# Altium schematic sheet BCM1.SchDoc
size A4; SheetNumber: 1; SheetTotal: 5
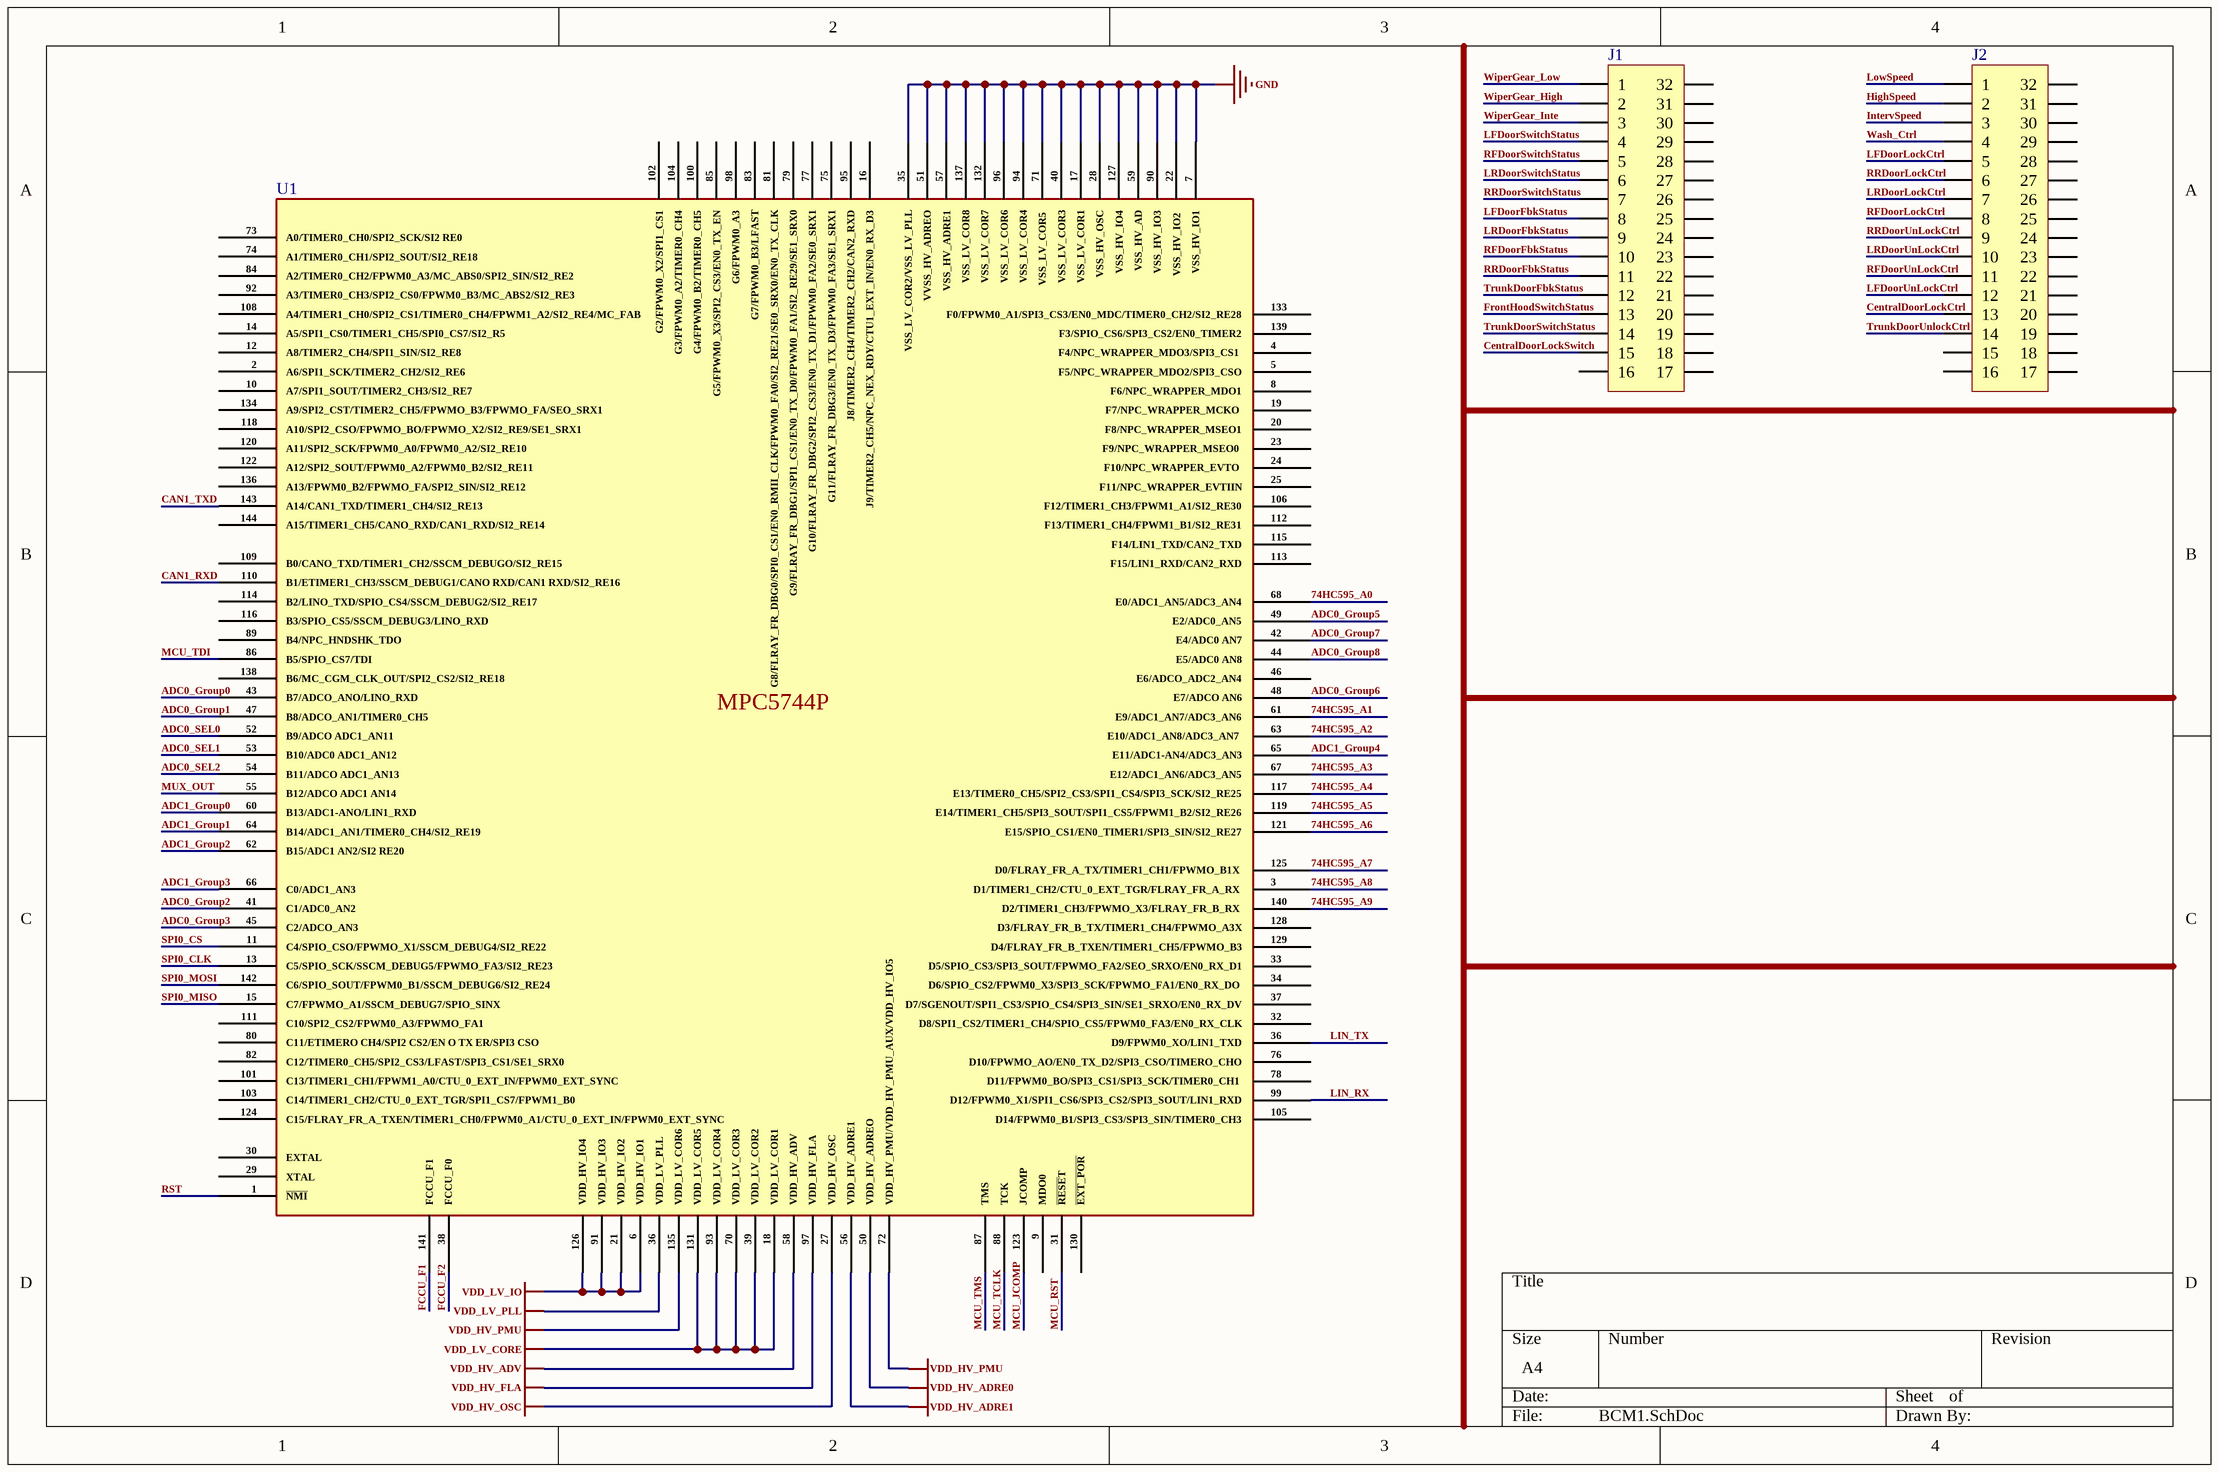
[diagram p0: BCM1.SchDoc]

## Parts
J1  DIP32  (value not drawn)
J2  DIP32  (value not drawn)
U1  MPC5744PFK1AMLQ9  (value not drawn)

## Nets
GND: U1.7(VSS_HV_IO1) U1.17(VSS_LV_COR1) U1.22(VSS_HV_IO2) U1.28(VSS_HV_OSC) U1.35(VSS_LV_COR2/VSS_LV_PLL) U1.40(VSS_LV_COR3) U1.51(VVSS_HV_ADREO) U1.57(VSS_HV_ADRE1) U1.59(VSS_HV_AD) U1.71(VSS_LV_COR5) U1.90(VSS_HV_IO3) U1.94(VSS_LV_COR4) U1.96(VSS_LV_COR6) U1.127(VSS_HV_IO4) U1.132(VSS_LV_COR7) U1.137(VSS_LV_COR8)
VDD_HV_ADRE0: U1.50(VDD_HV_ADREO)
VDD_HV_ADRE1: U1.56(VDD_HV_ADRE1)
VDD_HV_ADV: U1.58(VDD_HV_ADV)
VDD_HV_FLA: U1.97(VDD_HV_FLA)
VDD_HV_OSC: U1.27(VDD_HV_OSC)
VDD_HV_PMU: U1.72(VDD_HV_PMU/VDD_HV_PMU_AUX/VDD_HV_IO5) U1.135(VDD_LV_COR6)
VDD_LV_CORE: U1.18(VDD_LV_COR1) U1.39(VDD_LV_COR2) U1.70(VDD_LV_COR3) U1.93(VDD_LV_COR4) U1.131(VDD_LV_COR5)
VDD_LV_IO: U1.6(VDD_HV_IO1) U1.21(VDD_HV_IO2) U1.91(VDD_HV_IO3) U1.126(VDD_HV_IO4)
VDD_LV_PLL: U1.36(VDD_LV_PLL)
74HC595_A0: U1.68(E0/ADC1_AN5/ADC3_AN4)
74HC595_A1: U1.61(E9/ADC1_AN7/ADC3_AN6)
74HC595_A2: U1.63(E10/ADC1_AN8/ADC3_AN7)
74HC595_A3: U1.67(E12/ADC1_AN6/ADC3_AN5)
74HC595_A4: U1.117(E13/TIMER0_CH5/SPI2_CS3/SPI1_CS4/SPI3_SCK/SI2_RE25)
74HC595_A5: U1.119(E14/TIMER1_CH5/SPI3_SOUT/SPI1_CS5/FPWM1_B2/SI2_RE26)
74HC595_A6: U1.121(E15/SPIO_CS1/EN0_TIMER1/SPI3_SIN/SI2_RE27)
74HC595_A7: U1.125(D0/FLRAY_FR_A_TX/TIMER1_CH1/FPWMO_B1X)
74HC595_A8: U1.3(D1/TIMER1_CH2/CTU_0_EXT_TGR/FLRAY_FR_A_RX)
74HC595_A9: U1.140(D2/TIMER1_CH3/FPWMO_X3/FLRAY_FR_B_RX)
ADC0_Group0: U1.43(B7/ADCO_ANO/LINO_RXD)
ADC0_Group1: U1.47(B8/ADCO_AN1/TIMER0_CH5)
ADC0_Group2: U1.41(C1/ADC0_AN2)
ADC0_Group3: U1.45(C2/ADCO_AN3)
ADC0_Group5: U1.49(E2/ADC0_AN5)
ADC0_Group6: U1.48(E7/ADCO_AN6)
ADC0_Group7: U1.42(E4/ADC0_AN7)
ADC0_Group8: U1.44(E5/ADC0_AN8)
ADC0_SEL0: U1.52(B9/ADCO_ADC1_AN11)
ADC0_SEL1: U1.53(B10/ADC0_ADC1_AN12)
ADC0_SEL2: U1.54(B11/ADCO_ADC1_AN13)
ADC1_Group0: U1.60(B13/ADC1-ANO/LIN1_RXD)
ADC1_Group1: U1.64(B14/ADC1_AN1/TIMER0_CH4/SI2_RE19)
ADC1_Group2: U1.62(B15/ADC1_AN2/SI2_RE20)
ADC1_Group3: U1.66(C0/ADC1_AN3)
ADC1_Group4: U1.65(E11/ADC1-AN4/ADC3_AN3)
CAN1_RXD: U1.110(B1/ETIMER1_CH3/SSCM_DEBUG1/CANO_RXD/CAN1_RXD/SI2_RE16)
CAN1_TXD: U1.143(A14/CAN1_TXD/TIMER1_CH4/SI2_RE13)
CentralDoorLockCtrl: J2.13
CentralDoorLockSwitch: J1.15
FCCU_F1: U1.141(FCCU_F1)
FCCU_F2: U1.38(FCCU_F0)
FrontHoodSwitchStatus: J1.13
HighSpeed: J2.2
IntervSpeed: J2.3
LFDoorFbkStatus: J1.8
LFDoorLockCtrl: J2.5
LFDoorSwitchStatus: J1.4
LFDoorUnLockCtrl: J2.12
LIN_RX: U1.99(D12/FPWM0_X1/SPI1_CS6/SPI3_CS2/SPI3_SOUT/LIN1_RXD)
LIN_TX: U1.36(D9/FPWM0_XO/LIN1_TXD)
LowSpeed: J2.1
LRDoorFbkStatus: J1.9
LRDoorLockCtrl: J2.7
LRDoorSwitchStatus: J1.6
LRDoorUnLockCtrl: J2.10
MCU_JCOMP: U1.123(JCOMP)
MCU_RST: U1.31(~{RESE}T)
MCU_TCLK: U1.88(TCK)
MCU_TDI: U1.86(B5/SPIO_CS7/TDI)
MCU_TMS: U1.87(TMS)
MUX_OUT: U1.55(B12/ADCO_ADC1_AN14)
RFDoorFbkStatus: J1.10
RFDoorLockCtrl: J2.8
RFDoorSwitchStatus: J1.5
RFDoorUnLockCtrl: J2.11
RRDoorFbkStatus: J1.11
RRDoorLockCtrl: J2.6
RRDoorSwitchStatus: J1.7
RRDoorUnLockCtrl: J2.9
RST: U1.1(~{NMI})
SPI0_CLK: U1.13(C5/SPIO_SCK/SSCM_DEBUG5/FPWMO_FA3/SI2_RE23)
SPI0_CS: U1.11(C4/SPIO_CSO/FPWMO_X1/SSCM_DEBUG4/SI2_RE22)
SPI0_MISO: U1.15(C7/FPWMO_A1/SSCM_DEBUG7/SPIO_SINX)
SPI0_MOSI: U1.142(C6/SPIO_SOUT/FPWM0_B1/SSCM_DEBUG6/SI2_RE24)
TrunkDoorFbkStatus: J1.12
TrunkDoorSwitchStatus: J1.14
TrunkDoorUnlockCtrl: J2.14
Wash_Ctrl: J2.4
WiperGear_High: J1.2
WiperGear_Inte: J1.3
WiperGear_Low: J1.1

Not connected (* = marked no-connect by the designer): J1 16 17 18 19 20 21 22 23 24 25 26 27 28 29 30 31 32; J2 15 16 17 18 19 20 21 22 23 24 25 26 27 28 29 30 31 32; U1 2(A6/SPI1_SCK/TIMER2_CH2/SI2_RE6) 4(F4/NPC_WRAPPER_MDO3/SPI3_CS1_) 5(F5/NPC_WRAPPER_MDO2/SPI3_CSO) 8(F6/NPC_WRAPPER_MDO1) 9(MDO0) 10(A7/SPI1_SOUT/TIMER2_CH3/SI2_RE7) 12(A8/TIMER2_CH4/SPI1_SIN/SI2_RE8) 14(A5/SPI1_CS0/TIMER1_CH5/SPI0_CS7/SI2_R5) 16(J9/TIMER2_CH5/NPC_NEX_RDY/CTU1_EXT_IN/EN0_RX_D3) 19(F7/NPC_WRAPPER_MCKO_) 20(F8/NPC_WRAPPER_MSEO1) 23(F9/NPC_WRAPPER_MSEO0_) 24(F10/NPC_WRAPPER_EVTO_) 25(F11/NPC_WRAPPER_EVTIIN) 29(XTAL) 30(EXTAL) 32(D8/SPI1_CS2/TIMER1_CH4/SPIO_CS5/FPWM0_FA3/EN0_RX_CLK) 33(D5/SPIO_CS3/SPI3_SOUT/FPWMO_FA2/SEO_SRXO/EN0_RX_D1) 34(D6/SPIO_CS2/FPWM0_X3/SPI3_SCK/FPWMO_FA1/EN0_RX_DO_) 37(D7/SGENOUT/SPI1_CS3/SPIO_CS4/SPI3_SIN/SE1_SRXO/EN0_RX_DV) 46(E6/ADCO_ADC2_AN4) 73(A0/TIMER0_CH0/SPI2_SCK/SI2_RE0) 74(A1/TIMER0_CH1/SPI2_SOUT/SI2_RE18) 75(G11/FLRAY_FR_DBG3/EN0_TX_D3/FPWM0_FA3/SE1_SRX1) 76(D10/FPWMO_AO/EN0_TX_D2/SPI3_CSO/TIMERO_CHO) 77(G10/FLRAY_FR_DBG2/SPI2_CS3/EN0_TX_D1/FPWM0_FA2/SE0_SRX1) 78(D11/FPWM0_BO/SPI3_CS1/SPI3_SCK/TIMER0_CH1_) 79(G9/FLRAY_FR_DBG1/SPI1_CS1/EN0_TX_D0/FPWM0_FA1/SI2_RE29/SE1_SRX0) 80(C11/ETIMERO_CH4/SPI2_CS2/EN_O_TX_ER/SPI3_CSO) 81(G8/FLRAY_FR_DBG0/SPI0_CS1/EN0_RMII_CLK/FPWM0_FA0/SI2_RE21/SE0_SRX0/EN0_TX_CLK) 82(C12/TIMER0_CH5/SPI2_CS3/LFAST/SPI3_CS1/SE1_SRX0) 83(G7/FPWM0_B3/LFAST) 84(A2/TIMER0_CH2/FPWM0_A3/MC_ABS0/SPI2_SIN/SI2_RE2) 85(G5/FPWM0_X3/SPI2_CS3/EN0_TX_EN) 89(B4/NPC_HNDSHK_TDO) 92(A3/TIMER0_CH3/SPI2_CS0/FPWM0_B3/MC_ABS2/SI2_RE3) 95(J8/TIMER2_CH4/TIMER2_CH2/CAN2_RXD) 98(G6/FPWM0_A3) 100(G4/FPWM0_B2/TIMER0_CH5) 101(C13/TIMER1_CH1/FPWM1_A0/CTU_0_EXT_IN/FPWM0_EXT_SYNC) 102(G2/FPWM0_X2/SPI1_CS1) 103(C14/TIMER1_CH2/CTU_0_EXT_TGR/SPI1_CS7/FPWM1_B0) 104(G3/FPWM0_A2/TIMER0_CH4) 105(D14/FPWM0_B1/SPI3_CS3/SPI3_SIN/TIMER0_CH3) 106(F12/TIMER1_CH3/FPWM1_A1/SI2_RE30) 108(A4/TIMER1_CH0/SPI2_CS1/TIMER0_CH4/FPWM1_A2/SI2_RE4/MC_FAB_) 109(B0/CANO_TXD/TIMER1_CH2/SSCM_DEBUGO/SI2_RE15) 111(C10/SPI2_CS2/FPWM0_A3/FPWMO_FA1) 112(F13/TIMER1_CH4/FPWM1_B1/SI2_RE31) 113(F15/LIN1_RXD/CAN2_RXD) 114(B2/LINO_TXD/SPIO_CS4/SSCM_DEBUG2/SI2_RE17) 115(F14/LIN1_TXD/CAN2_TXD) 116(B3/SPIO_CS5/SSCM_DEBUG3/LINO_RXD) 118(A10/SPI2_CSO/FPWMO_BO/FPWMO_X2/SI2_RE9/SE1_SRX1) 120(A11/SPI2_SCK/FPWM0_A0/FPWM0_A2/SI2_RE10) 122(A12/SPI2_SOUT/FPWM0_A2/FPWM0_B2/SI2_RE11) 124(C15/FLRAY_FR_A_TXEN/TIMER1_CH0/FPWM0_A1/CTU_0_EXT_IN/FPWM0_EXT_SYNC) 128(D3/FLRAY_FR_B_TX/TIMER1_CH4/FPWMO_A3X) 129(D4/FLRAY_FR_B_TXEN/TIMER1_CH5/FPWMO_B3) 130(~{EXT_POR}) 133(F0/FPWM0_A1/SPI3_CS3/EN0_MDC/TIMER0_CH2/SI2_RE28) 134(A9/SPI2_CST/TIMER2_CH5/FPWMO_B3/FPWMO_FA/SEO_SRX1_) 136(A13/FPWM0_B2/FPWMO_FA/SPI2_SIN/SI2_RE12) 138(B6/MC_CGM_CLK_OUT/SPI2_CS2/SI2_RE18) 139(F3/SPIO_CS6/SPI3_CS2/EN0_TIMER2) 144(A15/TIMER1_CH5/CANO_RXD/CAN1_RXD/SI2_RE14)

## Notes on the sheet
- (in symbol MPC5744PFK1AMLQ9) MPC5744P